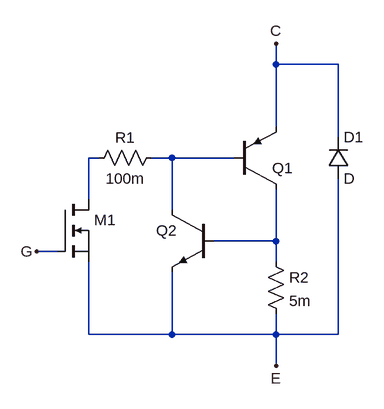
[diagram p0: schematic IGBT.asc]
IGBT.asc, the LTspice schematic file:
Version 4
SHEET 1 880 680
WIRE 304 -64 304 -96
WIRE 400 -64 304 -64
WIRE 304 32 304 -64
WIRE 400 48 400 -64
WIRE 32 80 16 80
WIRE 144 80 112 80
WIRE 240 80 144 80
WIRE 16 144 16 80
WIRE 144 160 144 80
WIRE 304 208 304 128
WIRE 304 208 208 208
WIRE -32 224 -64 224
WIRE 304 240 304 208
WIRE 16 352 16 240
WIRE 144 352 144 256
WIRE 144 352 16 352
WIRE 304 352 304 320
WIRE 304 352 144 352
WIRE 400 352 400 112
WIRE 400 352 304 352
WIRE 304 400 304 352
FLAG -64 224 G
FLAG 304 400 E
FLAG 304 -96 C
SYMBOL nmos -32 144 R0
WINDOW 3 56 72 Invisible 2
SYMATTR Value Si4982DY
SYMATTR InstName M1
SYMBOL pnp 240 128 M180
WINDOW 0 58 32 Left 2
WINDOW 3 84 68 Invisible 2
SYMATTR InstName Q1
SYMATTR Value FJL4215
SYMBOL diode 384 112 M180
WINDOW 0 24 64 Left 2
WINDOW 3 24 0 Left 2
SYMATTR InstName D1
SYMBOL res 128 64 R90
WINDOW 0 0 56 VBottom 2
WINDOW 3 32 56 VTop 2
SYMATTR InstName R1
SYMATTR Value 100m
SYMBOL res 288 224 R0
SYMATTR InstName R2
SYMATTR Value 5m
SYMBOL npn 208 160 M0
WINDOW 3 56 68 Invisible 2
SYMATTR Value FJL4315
SYMATTR InstName Q2

The netlist it stands for:
* IGBT.asc
M1 N001 G E E Si4982DY
Q1 N003 N002 C 0 FJL4215
D1 E C D
R1 N002 N001 100m
R2 N003 E 5m
Q2 N002 N003 E 0 FJL4315
.model D D
.lib standard.dio
.model NPN NPN
.model PNP PNP
.lib standard.bjt
.model NMOS NMOS
.model PMOS PMOS
.lib standard.mos
.backanno
.end